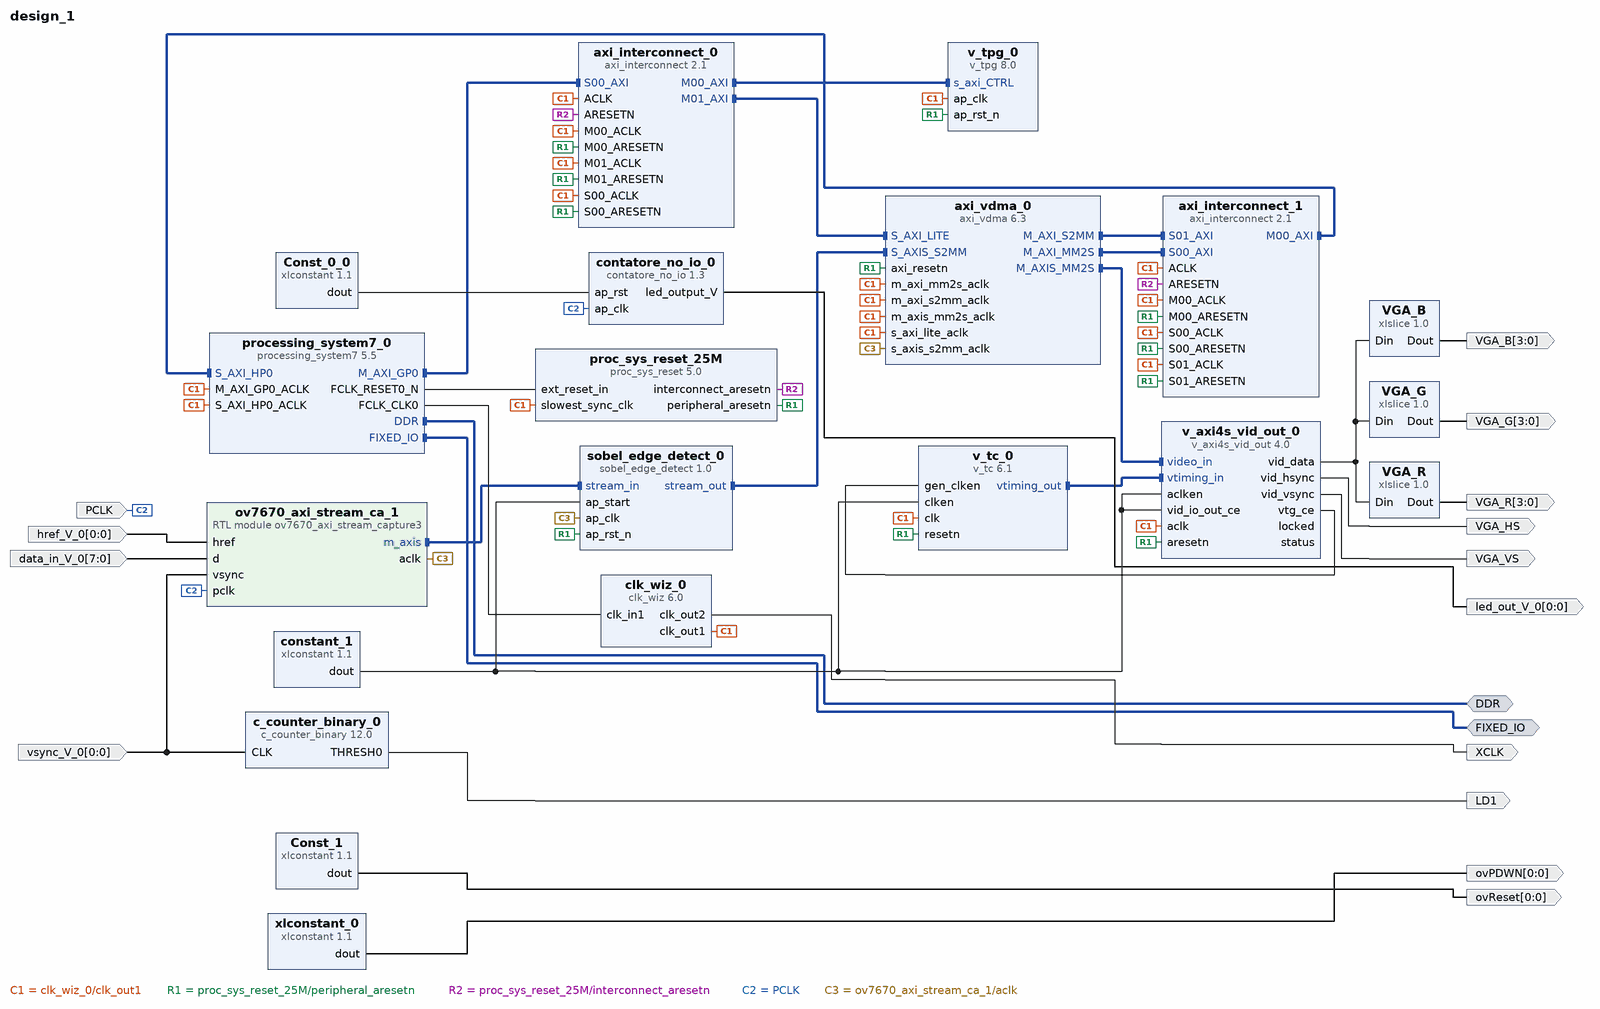
[diagram p0: block diagram of the top level]
# Vivado block design design_1, xc7z020clg484-1, Vivado 2018.3.1
create_bd_design design_1

create_bd_intf_port -mode Master -vlnv xilinx.com:interface:ddrx_rtl:1.0 DDR
create_bd_intf_port -mode Master -vlnv xilinx.com:display_processing_system7:fixedio_rtl:1.0 FIXED_IO
create_bd_port -dir O VGA_HS
create_bd_port -dir O VGA_VS
create_bd_port -dir O -from 3 -to 0 VGA_G
create_bd_port -dir O -from 3 -to 0 VGA_B
create_bd_port -dir O -from 3 -to 0 VGA_R
create_bd_port -dir I -type clk PCLK
create_bd_port -dir I -from 7 -to 0 -type data data_in_V_0
set_property -dict [list \
  CONFIG.LAYERED_METADATA {xilinx.com:interface:datatypes:1.0 {DATA {datatype {name {attribs {resolve_type immediate dependency {} format string minimum {} maximum {}} value {}} bitwidth {attribs {resolve_type immediate dependency {} format long minimum {} maximum {}} value 8} bitoffset {attribs {resolve_type immediate dependency {} format long minimum {} maximum {}} value 0} integer {signed {attribs {resolve_type immediate dependency {} format bool minimum {} maximum {}} value false}}}}}} \
] [get_bd_ports data_in_V_0]
create_bd_port -dir I -from 0 -to 0 -type data href_V_0
set_property -dict [list \
  CONFIG.LAYERED_METADATA {xilinx.com:interface:datatypes:1.0 {DATA {datatype {name {attribs {resolve_type immediate dependency {} format string minimum {} maximum {}} value {}} bitwidth {attribs {resolve_type immediate dependency {} format long minimum {} maximum {}} value 1} bitoffset {attribs {resolve_type immediate dependency {} format long minimum {} maximum {}} value 0} integer {signed {attribs {resolve_type immediate dependency {} format bool minimum {} maximum {}} value false}}}}}} \
] [get_bd_ports href_V_0]
create_bd_port -dir I -from 0 -to 0 -type data vsync_V_0
set_property -dict [list \
  CONFIG.LAYERED_METADATA {xilinx.com:interface:datatypes:1.0 {DATA {datatype {name {attribs {resolve_type immediate dependency {} format string minimum {} maximum {}} value {}} bitwidth {attribs {resolve_type immediate dependency {} format long minimum {} maximum {}} value 1} bitoffset {attribs {resolve_type immediate dependency {} format long minimum {} maximum {}} value 0} integer {signed {attribs {resolve_type immediate dependency {} format bool minimum {} maximum {}} value false}}}}}} \
] [get_bd_ports vsync_V_0]
create_bd_port -dir O -type clk XCLK
set_property -dict {CONFIG.FREQ_HZ 24023437} [get_bd_ports XCLK]
create_bd_port -dir O -from 0 -to 0 ovReset
create_bd_port -dir O -from 0 -to 0 ovPDWN
create_bd_port -dir O -from 0 -to 0 -type data led_out_V_0
create_bd_port -dir O -type data LD1

create_bd_cell -type ip -vlnv xilinx.com:ip:processing_system7:5.5 processing_system7_0
set_property -dict [list \
  CONFIG.PCW_APU_PERIPHERAL_FREQMHZ 666.666667 \
  CONFIG.PCW_ENET0_ENET0_IO {MIO 16 .. 27} \
  CONFIG.PCW_ENET0_GRP_MDIO_ENABLE 1 \
  CONFIG.PCW_ENET0_GRP_MDIO_IO {MIO 52 .. 53} \
  CONFIG.PCW_ENET0_PERIPHERAL_ENABLE 1 \
  CONFIG.PCW_ENET0_RESET_ENABLE 0 \
  CONFIG.PCW_ENET_RESET_ENABLE 1 \
  CONFIG.PCW_ENET_RESET_SELECT {Share reset pin} \
  CONFIG.PCW_FPGA0_PERIPHERAL_FREQMHZ 100.000000 \
  CONFIG.PCW_FPGA1_PERIPHERAL_FREQMHZ 150.000000 \
  CONFIG.PCW_GPIO_MIO_GPIO_ENABLE 1 \
  CONFIG.PCW_GPIO_MIO_GPIO_IO MIO \
  CONFIG.PCW_I2C0_GRP_INT_ENABLE 0 \
  CONFIG.PCW_I2C0_I2C0_IO {MIO 10 .. 11} \
  CONFIG.PCW_I2C0_PERIPHERAL_ENABLE 1 \
  CONFIG.PCW_I2C_PERIPHERAL_FREQMHZ 111.111115 \
  CONFIG.PCW_I2C_RESET_ENABLE 1 \
  CONFIG.PCW_I2C_RESET_SELECT {Share reset pin} \
  CONFIG.PCW_PRESET_BANK1_VOLTAGE {LVCMOS 1.8V} \
  CONFIG.PCW_QSPI_GRP_SINGLE_SS_ENABLE 1 \
  CONFIG.PCW_QSPI_GRP_SINGLE_SS_IO {MIO 1 .. 6} \
  CONFIG.PCW_QSPI_PERIPHERAL_ENABLE 1 \
  CONFIG.PCW_QSPI_QSPI_IO {MIO 1 .. 6} \
  CONFIG.PCW_SD0_GRP_CD_ENABLE 1 \
  CONFIG.PCW_SD0_GRP_CD_IO {MIO 47} \
  CONFIG.PCW_SD0_GRP_WP_ENABLE 1 \
  CONFIG.PCW_SD0_GRP_WP_IO {MIO 46} \
  CONFIG.PCW_SD0_PERIPHERAL_ENABLE 1 \
  CONFIG.PCW_SD0_SD0_IO {MIO 40 .. 45} \
  CONFIG.PCW_SDIO_PERIPHERAL_FREQMHZ 50 \
  CONFIG.PCW_SINGLE_QSPI_DATA_MODE x4 \
  CONFIG.PCW_TTC0_PERIPHERAL_ENABLE 1 \
  CONFIG.PCW_TTC0_TTC0_IO EMIO \
  CONFIG.PCW_UART1_PERIPHERAL_ENABLE 1 \
  CONFIG.PCW_UART1_UART1_IO {MIO 48 .. 49} \
  CONFIG.PCW_UART_PERIPHERAL_FREQMHZ 50 \
  CONFIG.PCW_UIPARAM_DDR_FREQ_MHZ 533.333313 \
  CONFIG.PCW_UIPARAM_DDR_PARTNO {MT41J128M16 HA-15E} \
  CONFIG.PCW_USB0_PERIPHERAL_ENABLE 1 \
  CONFIG.PCW_USB0_RESET_ENABLE 0 \
  CONFIG.PCW_USB0_USB0_IO {MIO 28 .. 39} \
  CONFIG.PCW_USB_RESET_ENABLE 1 \
  CONFIG.PCW_USB_RESET_SELECT {Share reset pin} \
  CONFIG.PCW_USE_S_AXI_HP0 1 \
  CONFIG.preset ZedBoard \
] [get_bd_cells processing_system7_0]
# 225 more settings of processing_system7_0 are not shown: defaults, MIO pin electricals, DDR timing, and values the tool derives
create_bd_cell -type ip -vlnv xilinx.com:ip:proc_sys_reset:5.0 proc_sys_reset_25M
create_bd_cell -type ip -vlnv xilinx.com:ip:clk_wiz:6.0 clk_wiz_0
set_property -dict [list \
  CONFIG.CLKOUT1_JITTER 246.419 \
  CONFIG.CLKOUT1_PHASE_ERROR 135.883 \
  CONFIG.CLKOUT1_REQUESTED_OUT_FREQ 25.20 \
  CONFIG.CLKOUT2_JITTER 248.745 \
  CONFIG.CLKOUT2_PHASE_ERROR 135.883 \
  CONFIG.CLKOUT2_REQUESTED_OUT_FREQ 24 \
  CONFIG.CLKOUT2_USED true \
  CONFIG.MMCM_CLKFBOUT_MULT_F 15.375 \
  CONFIG.MMCM_CLKOUT0_DIVIDE_F 30.500 \
  CONFIG.MMCM_CLKOUT1_DIVIDE 32 \
  CONFIG.MMCM_DIVCLK_DIVIDE 2 \
  CONFIG.NUM_OUT_CLKS 2 \
  CONFIG.USE_LOCKED false \
  CONFIG.USE_RESET false \
] [get_bd_cells clk_wiz_0]
create_bd_cell -type ip -vlnv xilinx.com:ip:axi_interconnect:2.1 axi_interconnect_0
set_property -dict {CONFIG.NUM_MI 2} [get_bd_cells axi_interconnect_0]
create_bd_cell -type ip -vlnv xilinx.com:ip:v_tpg:8.0 v_tpg_0
create_bd_cell -type ip -vlnv xilinx.com:ip:v_axi4s_vid_out:4.0 v_axi4s_vid_out_0
create_bd_cell -type ip -vlnv xilinx.com:ip:v_tc:6.1 v_tc_0
set_property -dict {CONFIG.HAS_AXI4_LITE false CONFIG.VIDEO_MODE 640x480p CONFIG.enable_detection false} [get_bd_cells v_tc_0]
create_bd_cell -type ip -vlnv xilinx.com:ip:xlconstant:1.1 constant_1
create_bd_cell -type ip -vlnv xilinx.com:ip:xlslice:1.0 VGA_R
set_property -dict {CONFIG.DIN_FROM 3 CONFIG.DIN_TO 0 CONFIG.DIN_WIDTH 24 CONFIG.DOUT_WIDTH 4} [get_bd_cells VGA_R]
create_bd_cell -type ip -vlnv xilinx.com:ip:xlslice:1.0 VGA_B
set_property -dict {CONFIG.DIN_FROM 19 CONFIG.DIN_TO 16 CONFIG.DIN_WIDTH 24 CONFIG.DOUT_WIDTH 4} [get_bd_cells VGA_B]
create_bd_cell -type ip -vlnv xilinx.com:ip:xlslice:1.0 VGA_G
set_property -dict {CONFIG.DIN_FROM 11 CONFIG.DIN_TO 8 CONFIG.DIN_WIDTH 24 CONFIG.DOUT_WIDTH 4} [get_bd_cells VGA_G]
create_bd_cell -type ip -vlnv xilinx.com:ip:axi_vdma:6.3 axi_vdma_0
set_property -dict {CONFIG.c_m_axis_mm2s_tdata_width 24} [get_bd_cells axi_vdma_0]
create_bd_cell -type ip -vlnv xilinx.com:ip:axi_interconnect:2.1 axi_interconnect_1
set_property -dict {CONFIG.NUM_MI 1 CONFIG.NUM_SI 2} [get_bd_cells axi_interconnect_1]
create_bd_cell -type ip -vlnv xilinx.com:ip:xlconstant:1.1 Const_0_0
create_bd_cell -type ip -vlnv xilinx.com:ip:xlconstant:1.1 Const_1
create_bd_cell -type ip -vlnv xilinx.com:ip:xlconstant:1.1 xlconstant_0
set_property -dict {CONFIG.CONST_VAL 0} [get_bd_cells xlconstant_0]
create_bd_cell -type ip -vlnv Ugo:hls:contatore_no_io:1.3 contatore_no_io_0
create_bd_cell -type ip -vlnv xilinx.com:ip:c_counter_binary:12.0 c_counter_binary_0
set_property -dict [list \
  CONFIG.Output_Width 4 \
  CONFIG.Sync_Threshold_Output true \
  CONFIG.Threshold_Value F \
] [get_bd_cells c_counter_binary_0]
create_bd_cell -type module -reference ov7670_axi_stream_capture3 ov7670_axi_stream_ca_1
create_bd_cell -type ip -vlnv Ugo:hls:sobel_edge_detect:1.0 sobel_edge_detect_0

# ---- connections ----

connect_bd_intf_net [get_bd_intf_ports DDR] [get_bd_intf_pins processing_system7_0/DDR]
connect_bd_intf_net [get_bd_intf_pins v_tc_0/vtiming_out] [get_bd_intf_pins v_axi4s_vid_out_0/vtiming_in]
connect_bd_intf_net [get_bd_intf_ports FIXED_IO] [get_bd_intf_pins processing_system7_0/FIXED_IO]
connect_bd_intf_net [get_bd_intf_pins axi_vdma_0/M_AXI_S2MM] [get_bd_intf_pins axi_interconnect_1/S01_AXI]
connect_bd_intf_net [get_bd_intf_pins v_tpg_0/s_axi_CTRL] [get_bd_intf_pins axi_interconnect_0/M00_AXI]
connect_bd_intf_net [get_bd_intf_pins axi_vdma_0/M_AXI_MM2S] [get_bd_intf_pins axi_interconnect_1/S00_AXI]
connect_bd_intf_net [get_bd_intf_pins axi_interconnect_1/M00_AXI] [get_bd_intf_pins processing_system7_0/S_AXI_HP0]
connect_bd_intf_net [get_bd_intf_pins axi_interconnect_0/M01_AXI] [get_bd_intf_pins axi_vdma_0/S_AXI_LITE]
connect_bd_intf_net [get_bd_intf_pins axi_vdma_0/M_AXIS_MM2S] [get_bd_intf_pins v_axi4s_vid_out_0/video_in]
connect_bd_intf_net [get_bd_intf_pins axi_interconnect_0/S00_AXI] [get_bd_intf_pins processing_system7_0/M_AXI_GP0]
connect_bd_intf_net [get_bd_intf_pins sobel_edge_detect_0/stream_in] [get_bd_intf_pins ov7670_axi_stream_ca_1/m_axis]
connect_bd_intf_net [get_bd_intf_pins sobel_edge_detect_0/stream_out] [get_bd_intf_pins axi_vdma_0/S_AXIS_S2MM]
connect_bd_net [get_bd_pins processing_system7_0/FCLK_CLK0] [get_bd_pins clk_wiz_0/clk_in1]
connect_bd_net [get_bd_pins clk_wiz_0/clk_out1] \
  [get_bd_pins proc_sys_reset_25M/slowest_sync_clk] [get_bd_pins v_tpg_0/ap_clk] [get_bd_pins axi_interconnect_0/M00_ACLK] \
  [get_bd_pins axi_interconnect_0/S00_ACLK] [get_bd_pins axi_interconnect_0/ACLK] \
  [get_bd_pins processing_system7_0/M_AXI_GP0_ACLK] [get_bd_pins v_tc_0/clk] [get_bd_pins v_axi4s_vid_out_0/aclk] \
  [get_bd_pins processing_system7_0/S_AXI_HP0_ACLK] [get_bd_pins axi_interconnect_0/M01_ACLK] \
  [get_bd_pins axi_vdma_0/m_axi_mm2s_aclk] [get_bd_pins axi_vdma_0/m_axi_s2mm_aclk] [get_bd_pins axi_vdma_0/s_axi_lite_aclk] \
  [get_bd_pins axi_vdma_0/m_axis_mm2s_aclk] [get_bd_pins axi_interconnect_1/ACLK] [get_bd_pins axi_interconnect_1/M00_ACLK] \
  [get_bd_pins axi_interconnect_1/S00_ACLK] [get_bd_pins axi_interconnect_1/S01_ACLK]
connect_bd_net [get_bd_pins processing_system7_0/FCLK_RESET0_N] [get_bd_pins proc_sys_reset_25M/ext_reset_in]
connect_bd_net -net proc_sys_reset_0_peripheral_aresetn [get_bd_pins proc_sys_reset_25M/peripheral_aresetn] \
  [get_bd_pins v_tpg_0/ap_rst_n] [get_bd_pins axi_interconnect_0/M00_ARESETN] [get_bd_pins axi_interconnect_0/S00_ARESETN] \
  [get_bd_pins v_tc_0/resetn] [get_bd_pins v_axi4s_vid_out_0/aresetn] [get_bd_pins axi_interconnect_0/M01_ARESETN] \
  [get_bd_pins axi_interconnect_1/S01_ARESETN] [get_bd_pins axi_interconnect_1/S00_ARESETN] \
  [get_bd_pins axi_interconnect_1/M00_ARESETN] [get_bd_pins axi_vdma_0/axi_resetn] [get_bd_pins sobel_edge_detect_0/ap_rst_n]
connect_bd_net -net proc_sys_reset_0_interconnect_aresetn [get_bd_pins proc_sys_reset_25M/interconnect_aresetn] \
  [get_bd_pins axi_interconnect_0/ARESETN] [get_bd_pins axi_interconnect_1/ARESETN]
connect_bd_net [get_bd_pins constant_1/dout] \
  [get_bd_pins v_tc_0/clken] [get_bd_pins v_axi4s_vid_out_0/aclken] [get_bd_pins v_axi4s_vid_out_0/vid_io_out_ce] \
  [get_bd_pins sobel_edge_detect_0/ap_start]
connect_bd_net [get_bd_pins v_axi4s_vid_out_0/vtg_ce] [get_bd_pins v_tc_0/gen_clken]
connect_bd_net [get_bd_pins v_axi4s_vid_out_0/vid_hsync] [get_bd_ports VGA_HS]
connect_bd_net [get_bd_pins v_axi4s_vid_out_0/vid_vsync] [get_bd_ports VGA_VS]
connect_bd_net [get_bd_pins v_axi4s_vid_out_0/vid_data] [get_bd_pins VGA_R/Din] [get_bd_pins VGA_G/Din] [get_bd_pins VGA_B/Din]
connect_bd_net [get_bd_pins VGA_G/Dout] [get_bd_ports VGA_G]
connect_bd_net [get_bd_pins VGA_B/Dout] [get_bd_ports VGA_B]
connect_bd_net [get_bd_pins VGA_R/Dout] [get_bd_ports VGA_R]
connect_bd_net -net ap_clk_0_1 [get_bd_ports PCLK] [get_bd_pins contatore_no_io_0/ap_clk] [get_bd_pins ov7670_axi_stream_ca_1/pclk]
connect_bd_net [get_bd_pins Const_0_0/dout] [get_bd_pins contatore_no_io_0/ap_rst]
connect_bd_net -net href_V_0_1 [get_bd_ports href_V_0] [get_bd_pins ov7670_axi_stream_ca_1/href]
connect_bd_net -net vsync_V_0_1 [get_bd_ports vsync_V_0] [get_bd_pins c_counter_binary_0/CLK] [get_bd_pins ov7670_axi_stream_ca_1/vsync]
connect_bd_net [get_bd_pins Const_1/dout] [get_bd_ports ovReset]
connect_bd_net [get_bd_pins clk_wiz_0/clk_out2] [get_bd_ports XCLK]
connect_bd_net [get_bd_pins xlconstant_0/dout] [get_bd_ports ovPDWN]
connect_bd_net [get_bd_pins contatore_no_io_0/led_output_V] [get_bd_ports led_out_V_0]
# net locked has one end: v_axi4s_vid_out_0/locked
# net status has one end: v_axi4s_vid_out_0/status
connect_bd_net [get_bd_pins c_counter_binary_0/THRESH0] [get_bd_ports LD1]
connect_bd_net -net data_in_V_0_1 [get_bd_ports data_in_V_0] [get_bd_pins ov7670_axi_stream_ca_1/d]
connect_bd_net [get_bd_pins ov7670_axi_stream_ca_1/aclk] [get_bd_pins axi_vdma_0/s_axis_s2mm_aclk] [get_bd_pins sobel_edge_detect_0/ap_clk]

# ---- address map ----
assign_bd_address -offset 0x00000000 -range 512M -target_address_space [get_bd_addr_spaces axi_vdma_0/Data_MM2S] [get_bd_addr_segs processing_system7_0/S_AXI_HP0/HP0_DDR_LOWOCM]
assign_bd_address -offset 0x00000000 -range 512M -target_address_space [get_bd_addr_spaces axi_vdma_0/Data_S2MM] [get_bd_addr_segs processing_system7_0/S_AXI_HP0/HP0_DDR_LOWOCM]
assign_bd_address -offset 0x43000000 -range 64K -target_address_space [get_bd_addr_spaces processing_system7_0/Data] [get_bd_addr_segs axi_vdma_0/S_AXI_LITE/Reg]
assign_bd_address -offset 0x43C00000 -range 64K -target_address_space [get_bd_addr_spaces processing_system7_0/Data] [get_bd_addr_segs v_tpg_0/s_axi_CTRL/Reg]

validate_bd_design
save_bd_design
